# EasyEDA schematic SCH_NIRV2_Driver_2022-05-06.json
TITLE: Near Infrared; REV: 1.0; Date: 18/03/2022; Sheet: 1/1; Company: Singapore Polytechnic
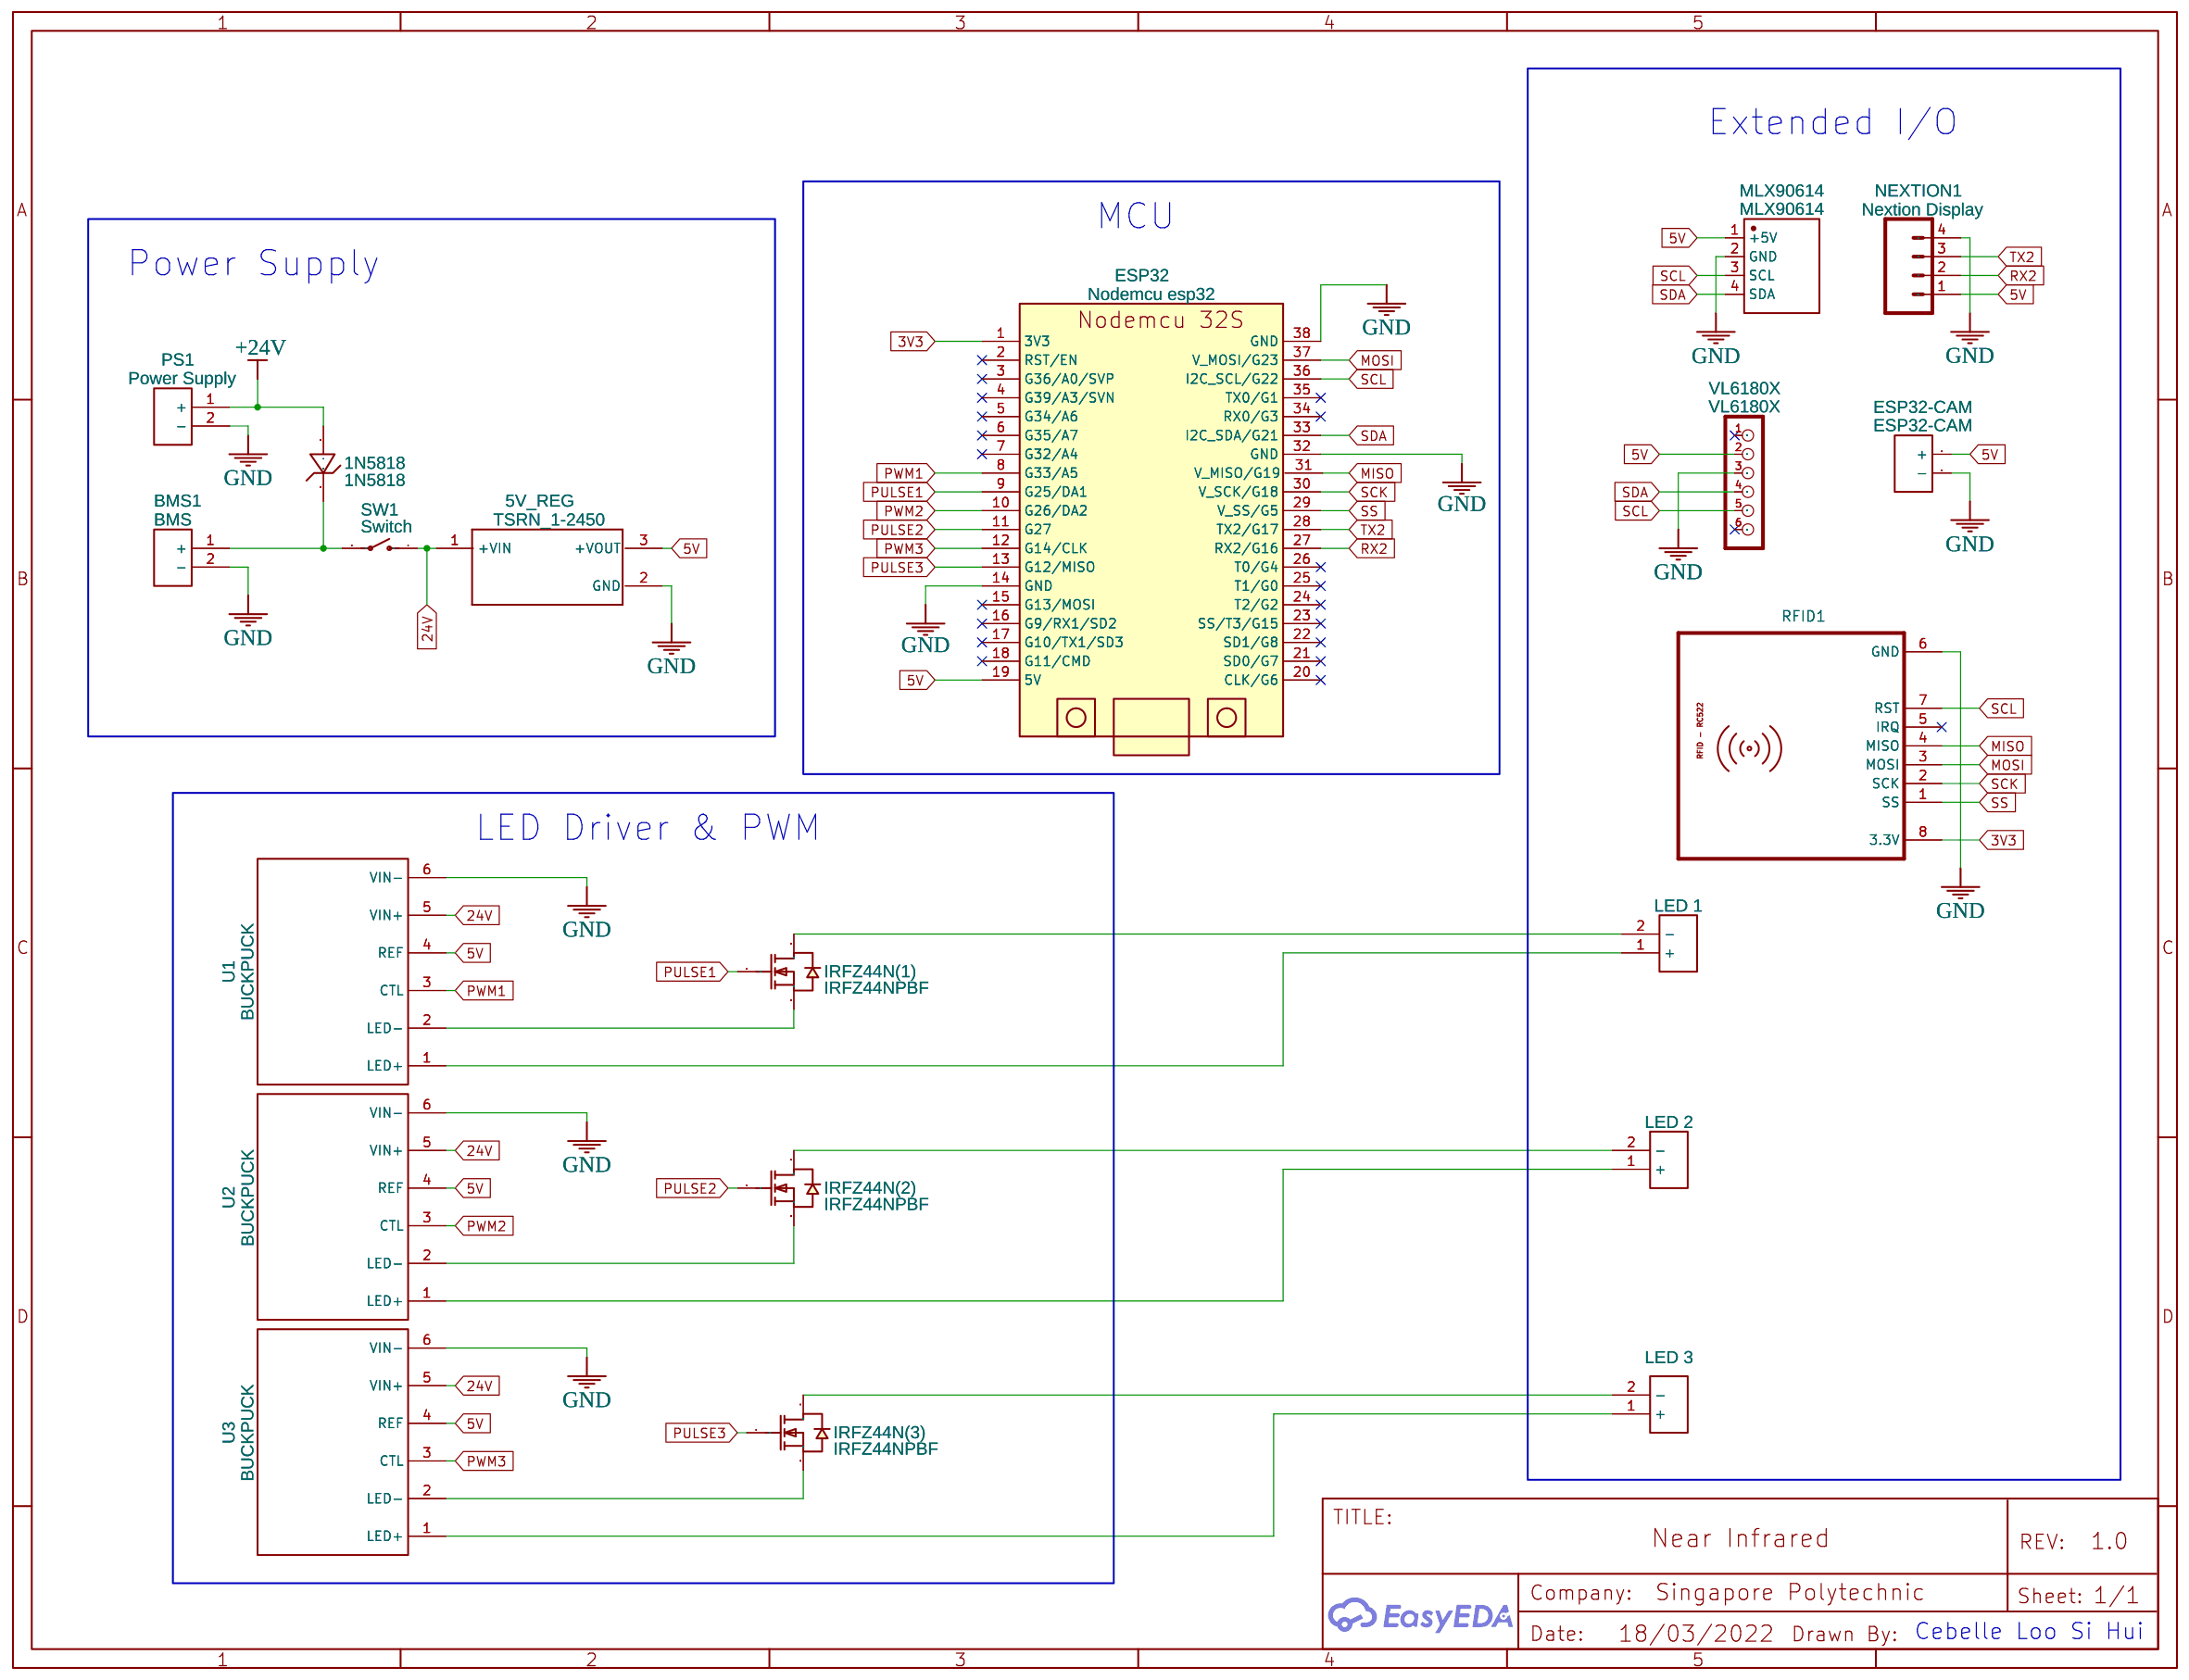
[diagram p0: schematic sheet]

## Parts
1N5818  1N5818  [DO-41_BD2.4-L4.7-P8.70-D0.9-RD]
5V_REG  TSRN_1-2450  [CONV_TSRN_1-2450]
BMS1  BMS  [2PIN-TERMINALBLOCK-5MM]
ESP32  Nodemcu esp32  [NODEMCU-ESP32S]
ESP32-CAM  ESP32-CAM  [HDR-TH_2P-P2.54-V-F]
IRFZ44N(1)  IRFZ44NPBF  [PG-TO220-3_L10.0-W4.5-P2.54-L]
IRFZ44N(2)  IRFZ44NPBF  [PG-TO220-3_L10.0-W4.5-P2.54-L]
IRFZ44N(3)  IRFZ44NPBF  [PG-TO220-3_L10.0-W4.5-P2.54-L]
LED1  LED 1  [2PIN-TERMINALBLOCK-5MM]
LED2  LED 2  [2PIN-TERMINALBLOCK-5MM]
LED3  LED 3  [2PIN-TERMINALBLOCK-5MM]
MLX90614  MLX90614  [HDR1X4]
NEXTION1  Nextion Display  [MOLEX-1X4]
PS1  Power Supply  [2PIN-TERMINALBLOCK-5MM]
RFID1  NO  [RC522 N]
SW1  Switch  [2PIN-TERMINALBLOCK-5MM]
U1  BUCKPUCK  [BUCKPUCK]
U2  BUCKPUCK  [BUCKPUCK]
U3  BUCKPUCK  [BUCKPUCK]
VL6180X  VL6180X  [M1X6]

## Library data of the parts
1N5818 = 1N5818: Supplier: LCSC; Supplier Part: C402217; Manufacturer: LGE; Contributor: LCSC; JLCPCB Part Class: Extended Part
5V_REG = TSRN_1-2450: Contributor: jakobaarestrup
BMS1 LED1 PS1 = WJ103-5.00-2P: Supplier: LCSC; Manufacturer: ReliaPro; Supplier Part: C8439; JLCPCB Part Class: Extended Part; Package Display: No
ESP32 = Nodemcu esp32: Contributor: SSanya
ESP32-CAM = Header-Female-2.54_1x2: Supplier: LCSC; Manufacturer: BOOMELE; Manufacturer Part: 2.54-1*2PFemale; Supplier Part: C49661; JLCPCB Part Class: Extended Part
IRFZ44N(1) IRFZ44N(2) IRFZ44N(3) = IRFZ44NPBF: Supplier: LCSC; Manufacturer: IR; Supplier Part: C2586; JLCPCB Part Class: Extended Part
LED2 LED3 = WJ103-5.00-2P: Supplier: LCSC; Manufacturer: ReliaPro; Supplier Part: C8439; JLCPCB Part Class: Extended Part
MLX90614 = RE-H042TD-1190(LF)(SN): Supplier: LCSC; Supplier Part: C265319; Manufacturer: JST Sales America; Contributor: LCSC
NEXTION1 = M04POLAR: Header 4; Contributor: SparkFun
SW1 = SWITCH-2P-SPST-Rocker-10x15mm: Manufacturer Part: KCD1-11-1.5x1cm; Supplier: Aliexpress; link: https://www.aliexpress.com/item/32920360920.html?spm=a2g0s.9042311.0.0.27424c4dCPvDQN; Contributor: shaman0
U1-U3 = BUCKPUCK: Contributor: 박종률
VL6180X = CON_HEADER_1X06-PTH: Contributor: DangerousPrototype

## Nets
3V3: ESP32.1(3V3) RFID1.8(3.3V)
5V: 5V_REG.3(+VOUT) ESP32.19(5V) ESP32-CAM.2(+) MLX90614.1(+5V) NEXTION1.1(GND) U1.4(REF) U2.4(REF) U3.4(REF) VL6180X.2(VIN)
24V: 5V_REG.1(+VIN) SW1.1(O) U1.5(VIN+) U2.5(VIN+) U3.5(VIN+)
+24V: 1N5818.2(A) PS1.1(+)
GND: 5V_REG.2(GND) BMS1.2(-) ESP32.14(GND) ESP32.32(GND) ESP32.38(GND) ESP32-CAM.1(-) MLX90614.2(GND) NEXTION1.4(+5V) PS1.2(-) RFID1.6(GND) U1.6(VIN-) U2.6(VIN-) U3.6(VIN-) VL6180X.3(GND)
MISO: ESP32.31(V_MISO/G19) RFID1.4(MISO)
MOSI: ESP32.37(V_MOSI/G23) RFID1.3(MOSI)
PULSE1: ESP32.9(G25/DA1) IRFZ44N(1).1(G)
PULSE2: ESP32.11(G27) IRFZ44N(2).1(G)
PULSE3: ESP32.13(G12/MISO) IRFZ44N(3).1(G)
PWM1: ESP32.8(G33/A5) U1.3(CTL)
PWM2: ESP32.10(G26/DA2) U2.3(CTL)
PWM3: ESP32.12(G14/CLK) U3.3(CTL)
RX2: ESP32.27(RX2/G16) NEXTION1.2(RX)
SCK: ESP32.30(V_SCK/G18) RFID1.2(SCK)
SCL: ESP32.36(I2C SCL/G22) MLX90614.3(SCL) RFID1.7(RST) VL6180X.5(SCL)
SDA: ESP32.33(I2C SDA/G21) MLX90614.4(SDA) VL6180X.4(SDA)
SS: ESP32.29(V_SS/G5) RFID1.1(SS)
TX2: ESP32.28(TX2/G17) NEXTION1.3(TX)
Net-(1N5818-1): 1N5818.1(C) BMS1.1(+) SW1.2(P)
Net-(IRFZ44N(1)-2): IRFZ44N(1).2(D) LED1.2(-)
Net-(IRFZ44N(1)-3): IRFZ44N(1).3(S) U1.2(LED-)
Net-(IRFZ44N(2)-2): IRFZ44N(2).2(D) LED2.2(-)
Net-(IRFZ44N(2)-3): IRFZ44N(2).3(S) U2.2(LED-)
Net-(IRFZ44N(3)-2): IRFZ44N(3).2(D) LED3.2(-)
Net-(IRFZ44N(3)-3): IRFZ44N(3).3(S) U3.2(LED-)
Net-(LED1-1): LED1.1(+) U1.1(LED+)
Net-(LED2-1): LED2.1(+) U2.1(LED+)
Net-(LED3-1): LED3.1(+) U3.1(LED+)

Not connected (* = marked no-connect by the designer): ESP32 2(RST/EN)* 3(G36/A0/SVP)* 4(G39/A3/SVN)* 5(G34/A6)* 6(G35/A7)* 7(G32/A4)* 15(G13/MOSI)* 16(G9/RX1/SD2)* 17(G10/TX1/SD3)* 18(G11/CMD)* 20(CLK/G6)* 21(SD0/G7)* 22(SD1/G8)* 23(SS/T3/G15)* 24(T2/G2)* 25(T1/G0)* 26(T0/G4)* 34(RX0/G3)* 35(TX0/G1)*; RFID1 5(IRQ)*; VL6180X 1(VDD)* 6(IO1)*

## Notes on the sheet
- Extended I/O
- MCU
- Power Supply
- LED Driver & PWM
- Cebelle Loo Si Hui
